# EAGLE design unity-gain-mixiple (EAGLE 7.7.0)
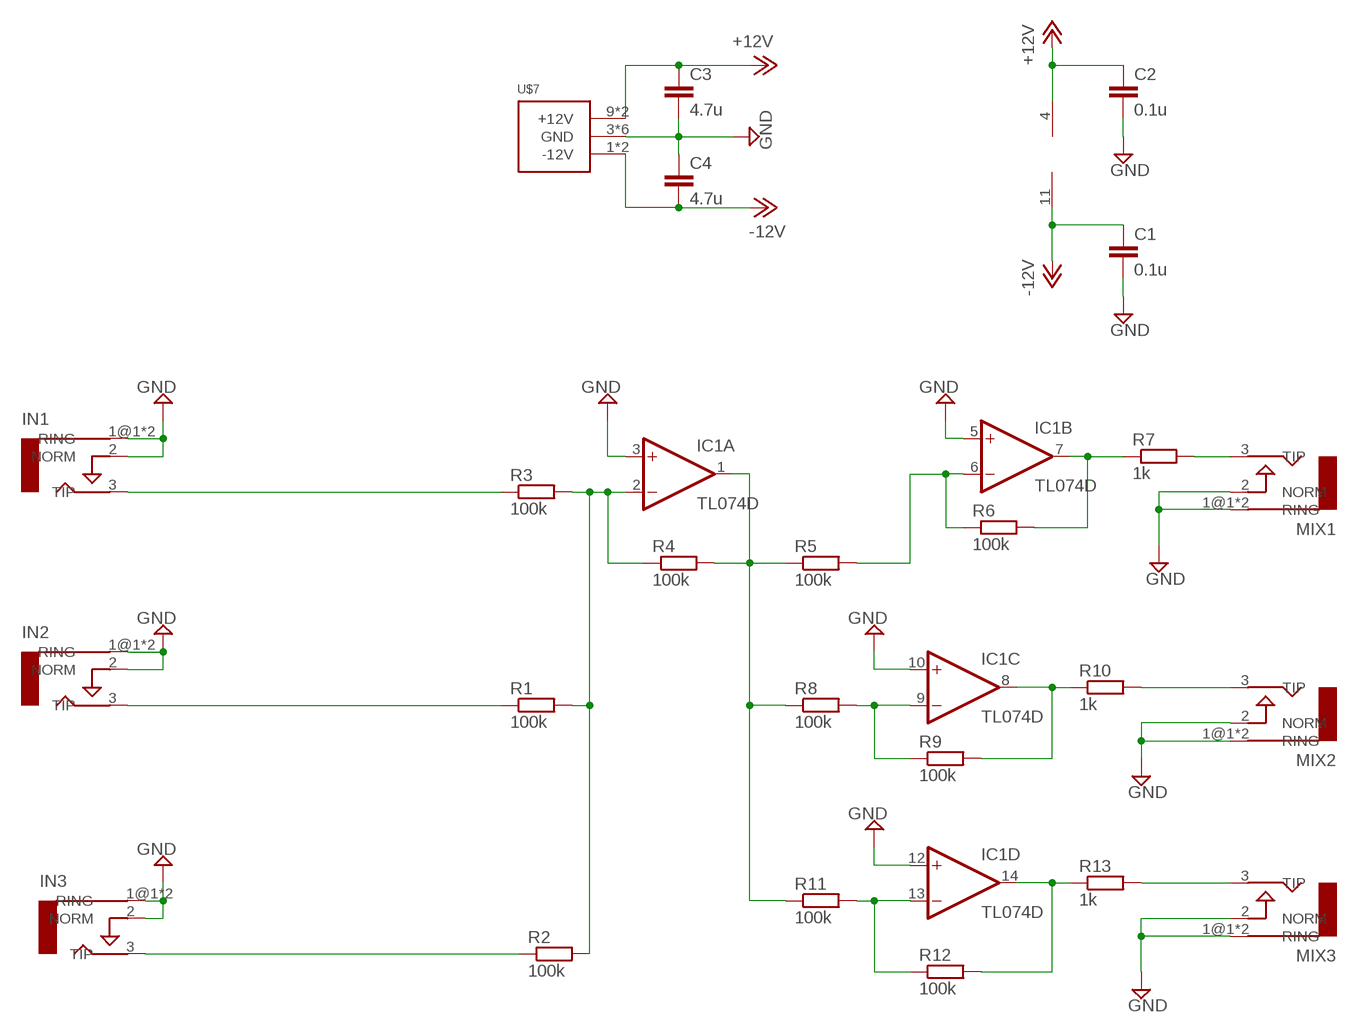
[diagram p0: schematic, sheet 1]

## Parts
C1  0.1u  C-EUC0805  [C0805]
C2  0.1u  C-EUC0805  [C0805]
C3  4.7u  C-EUC0805  [C0805]
C4  4.7u  C-EUC0805  [C0805]
IC1  TL074D  [SO14]
IN1  AUDIO-JACKERTHENVAR  [ERTHENVAR-JACK]
IN2  AUDIO-JACKERTHENVAR  [ERTHENVAR-JACK]
IN3  AUDIO-JACKERTHENVAR  [ERTHENVAR-JACK]
MIX1  AUDIO-JACKERTHENVAR  [ERTHENVAR-JACK]
MIX2  AUDIO-JACKERTHENVAR  [ERTHENVAR-JACK]
MIX3  AUDIO-JACKERTHENVAR  [ERTHENVAR-JACK]
R1  100k  R-EU_R0805  [R0805]
R2  100k  R-EU_R0805  [R0805]
R3  100k  R-EU_R0805  [R0805]
R4  100k  R-EU_R0805  [R0805]
R5  100k  R-EU_R0805  [R0805]
R6  100k  R-EU_R0805  [R0805]
R7  1k  R-EU_R0805  [R0805]
R8  100k  R-EU_R0805  [R0805]
R9  100k  R-EU_R0805  [R0805]
R10  1k  R-EU_R0805  [R0805]
R11  100k  R-EU_R0805  [R0805]
R12  100k  R-EU_R0805  [R0805]
R13  1k  R-EU_R0805  [R0805]
U$7  POWER_SIMPLE10  [POWER_10]

## Nets
+12V: C2.1 C3.1 IC1.4(P:V+) U$7.9(+12V) U$7.10(+12V)
-12V: C1.1 C4.2 IC1.11(P:V-) U$7.1(-12V) U$7.2(-12V)
GND: C1.2 C2.2 C3.2 C4.1 IC1.3(A:+IN) IC1.5(B:+IN) IC1.10(C:+IN) IC1.12(D:+IN) IN1.1@1(RING) IN1.1@2(RING) IN1.2(NORM) IN2.1@1(RING) IN2.1@2(RING) IN2.2(NORM) IN3.1@1(RING) IN3.1@2(RING) IN3.2(NORM) MIX1.1@1(RING) MIX1.1@2(RING) MIX1.2(NORM) MIX2.1@1(RING) MIX2.1@2(RING) MIX2.2(NORM) MIX3.1@1(RING) MIX3.1@2(RING) MIX3.2(NORM) U$7.3(GND) U$7.4(GND) U$7.5(GND) U$7.6(GND) U$7.7(GND) U$7.8(GND)
N$5: IC1.7(B:OUT) R6.2 R7.1
N$6: IC1.8(C:OUT) R9.2 R10.1
N$7: IC1.14(D:OUT) R12.2 R13.1
N$8: IC1.6(B:-IN) R5.2 R6.1
N$9: IC1.9(C:-IN) R8.2 R9.1
N$10: IC1.13(D:-IN) R11.2 R12.1
N$11: IN1.3(TIP) R3.1
N$12: IC1.2(A:-IN) R1.2 R2.2 R3.2 R4.1
N$13: IN2.3(TIP) R1.1
N$14: IN3.3(TIP) R2.1
N$15: IC1.1(A:OUT) R4.2 R5.1 R8.1 R11.1
N$17: MIX2.3(TIP) R10.2
N$18: MIX3.3(TIP) R13.2
N$19: MIX1.3(TIP) R7.2

## Library data of the parts
C1-C4 = rcl:C-EU: CAPACITOR, European symbol
IC1 = linear:TL074: OP AMP
IN1-IN3 MIX1-MIX3 = erthenvar:AUDIO-JACK: Switching Mono 3.5mm Audio Jack from Erthenvar.
R1-R13 = rcl:R-EU_: RESISTOR, European symbol
U$7 = eurorack:POWER_SIMPLE

## Board
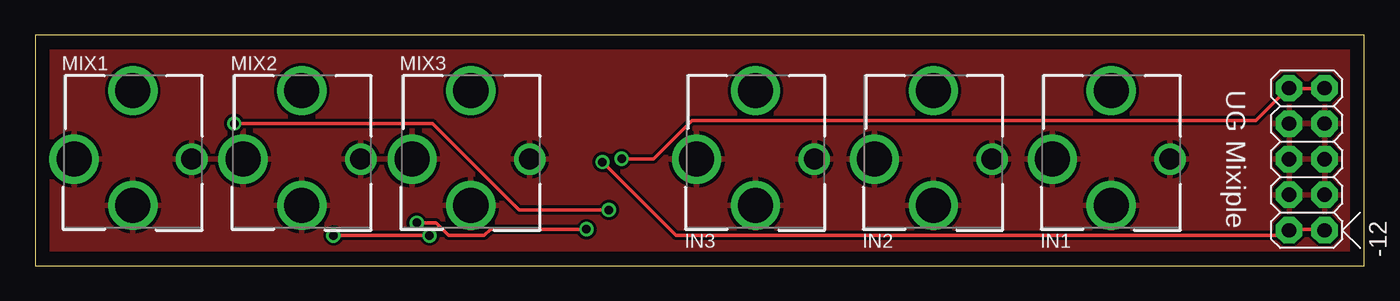
[diagram p1: board, top side]
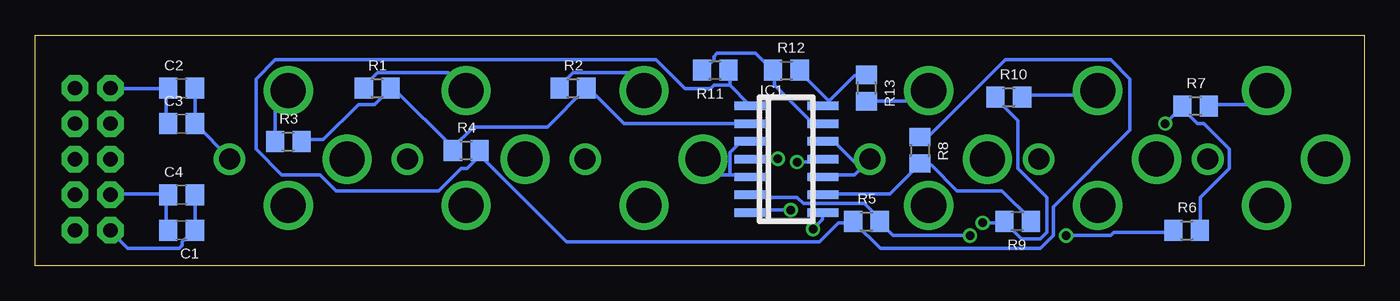
[diagram p2: board, bottom side, seen from below]

Size 94.92 x 16.5 mm. Coordinates in mm from the lower left corner, seen from the top.
Outline: 0,0 94.92,0 94.92,16.5 0,16.5 0,0
Copper layers (1*16): Top 0.035mm / dielectric 1.5mm / Bottom 0.035mm
Design rules "default": minimum track width 10mil, minimum drill 24mil, track to track 8mil, track to pad 8mil, pad to pad 8mil, via to via 8mil, smd to smd 8mil, copper to edge 40mil, drill to drill 8mil, minimum pad ring 10mil, minimum via ring 8mil, stop-mask expansion 4mil, vias tented up to drill 0mil, thermal gap 10mil

### Footprints (pad centres in the part's own frame; a part is rotated, then mirrored left to right if it is on the bottom)
C0805 = smd 1.3 x 1.5: 1 -0.95,0; 2 0.95,0
SO14 = smd 0.6 x 2.2: 1 -3.81,-2.6; 2 -2.54,-2.6; 3 -1.27,-2.6; 4 0,-2.6; 5 1.27,-2.6; 6 2.54,-2.6; 7 3.81,-2.6; 8 3.81,2.6; 9 2.54,2.6; 10 1.27,2.6; 11 0,2.6; 12 -1.27,2.6; 13 -2.54,2.6; 14 -3.81,2.6
ERTHENVAR-JACK = drill 2.5: 1@1 -4.2,0; 2 0,-3.3; 3 0,4.9 | drill 1.5: 1@2 4.2,0
R0805 = smd 1.3 x 1.5: 1 -0.95,0; 2 0.95,0
POWER_10 = drill 1.016 pad 1.88 octagon: 1 -5.08,-1.27; 2 -5.08,1.27; 3 -2.54,-1.27; 4 -2.54,1.27; 5 0,-1.27; 6 0,1.27; 7 2.54,-1.27; 8 2.54,1.27; 9 5.08,-1.27; 10 5.08,1.27

### Placement (x,y rotation side)
C1  84.45,2.54 180 bottom
C2  84.45,12.7 0 bottom
C3  84.45,10.16 0 bottom
C4  84.45,5.08 0 bottom
IC1  41.27,7.62 270 bottom
IN1  76.83,7.62 0 top
IN2  64.13,7.62 0 top
IN3  51.44,7.62 0 top
MIX1  6.99,7.62 0 top
MIX2  19.05,7.62 0 top
MIX3  31.11,7.62 0 top
R1  70.48,12.7 0 bottom
R2  56.52,12.7 0 bottom
R3  76.83,8.89 0 bottom
R4  64.13,8.26 0 bottom
R5  35.56,3.18 0 bottom
R6  12.7,2.54 0 bottom
R7  12.06,11.43 0 bottom
R8  31.75,8.26 270 bottom
R9  24.76,3.18 180 bottom
R10  25.4,12.07 0 bottom
R11  46.36,13.97 180 bottom
R12  41.27,13.97 0 bottom
R13  35.56,12.7 270 bottom
U$7  90.8,7.62 90 top

### Tracks (layer width: path | path; a pad name or v marks a point on that pad's centre or on a via)
+12V  (via drill 0.61)
  Top 0.254: v41.89,7.64 44.17,7.64 46.91,10.39 87.15,10.39 89.43,12.68 U$7.10 89.66,12.68 91.95,12.68 U$7.9
  Bottom 0.254: 85.55,12.68 85.55,10.16 C3.1 | v41.89,7.64 43.71,7.64 IC1.4 | 85.55,12.68 89.43,12.68 U$7.10 | 85.55,12.68 C2.1
-12V  (via drill 0.61)
  Top 0.254: v40.51,7.42 45.77,2.16 89.2,2.16 89.43,2.39 U$7.2 89.66,2.62 91.95,2.62 U$7.1
  Bottom 0.254: C4.2 83.49,4.9 83.49,2.62 C1.1 83.72,2.39 84.4,1.7 84.4,1.47 84.63,1.25 88.29,1.25 89.43,2.39 U$7.2 | v40.51,7.42 38.68,7.42 IC1.11
GND
  Bottom 0.254: 83.49,10.16 83.49,12.68 C2.2 | C1.2 85.55,2.62 85.55,4.9 C4.1 85.55,5.13 89.43,5.13 U$7.4 | 35.94,6.96 35.48,7.42 MIX3.1@2 35.94,6.96 | 35.94,6.96 36.4,6.5 38.46,6.5 IC1.10 | 45.31,6.5 46.23,6.5 47.14,7.42 IN3.1@1 | 45.31,6.5 43.94,6.5 IC1.5 | 35.94,6.96 37.77,8.79 38.46,8.79 IC1.12 | 45.31,6.5 45.31,8.1 44.63,8.79 43.94,8.79 IC1.3 | 83.49,10.16 80.97,7.64 IN1.1@2 | 83.49,10.16 C3.2
  pour Top: 0.64,16.51 94.61,16.51 94.61,0 0.64,0
N$5  (via drill 0.61)
  Top 0.254: v40.97,3.99 34.57,3.99 28.4,10.16 v14.22,10.16
  Bottom 0.254: 13.08,11.3 11.94,10.16 11.48,10.16 9.65,8.33 9.65,6.96 11.71,4.9 11.71,2.62 R6.2 | v40.97,3.99 43.71,3.99 IC1.7 | 13.08,11.3 v14.22,10.16 | 13.08,11.3 R7.1
N$6  (via drill 0.61)
  Top 0.254: v39.37,2.62 32.51,2.62 32.05,2.16 29.54,2.16 28.63,3.07 v27.25,3.07
  Bottom 0.254: R10.1 26.34,11.99 24.74,10.39 24.74,6.96 22.68,4.9 22.68,2.39 23.14,1.93 24.51,1.93 25.65,3.07 R9.2 25.88,3.07 v27.25,3.07 | v39.37,2.62 38.68,3.3 38.68,3.76 IC1.8
N$7
  Bottom 0.254: 38.23,11.76 38.46,11.53 IC1.14 | 38.23,11.76 36.4,13.59 35.71,13.59 R13.1 | 38.23,11.76 40.28,13.82 R12.2
N$8  (via drill 0.61)
  Top 0.254: v28.17,2.16 v21.31,2.16
  Bottom 0.254: v21.31,2.16 18.11,2.16 17.88,2.39 13.77,2.39 R6.1 | v28.17,2.16 33.66,2.16 34.57,3.07 R5.2 34.57,3.3 35.71,4.45 40.06,4.45 40.51,4.9 43.71,4.9 IC1.6
N$9
  Bottom 0.254: R9.1 23.82,3.3 25.88,5.36 29.08,5.36 30.91,7.19 31.6,7.19 R8.2 31.83,7.19 33.88,5.13 38.46,5.13 IC1.9
N$10
  Bottom 0.254: IC1.13 39.37,10.16 42.11,12.9 42.11,13.82 R12.1 42.34,14.05 43.48,15.19 46.23,15.19 46.46,14.96 46.46,14.73 47.14,14.05 R11.2
N$11
  Bottom 0.254: R3.1 77.77,9.02 77.77,11.53 76.86,12.45 IN1.3
N$12
  Bottom 0.254: R3.2 75.72,9.02 74.35,9.02 71.83,11.53 70.69,11.53 69.55,12.68 R1.2 69.32,12.68 64.97,8.33 R4.1 65.2,8.33 63.6,9.93 58.34,9.93 55.6,12.68 R2.2 55.37,12.68 52.86,10.16 IC1.2
N$13
  Bottom 0.254: R1.1 71.37,12.9 70.46,13.82 65.43,13.82 64.29,12.68 IN2.3
N$14
  Bottom 0.254: R2.1 57.43,12.9 56.52,13.82 52.63,13.82 51.49,12.68 IN3.3
N$15
  Bottom 0.254: 45.31,12.9 45.31,13.82 R11.1 | 45.31,12.9 43.94,11.53 IC1.1 | 63.14,7.87 63.37,8.1 R4.2 63.14,7.87 | 63.14,7.87 56.97,1.7 38.91,1.7 37.54,3.07 36.63,3.07 R5.1 36.4,3.07 34.57,1.25 23.14,1.25 22.22,2.16 22.22,4.22 16.74,9.7 16.74,13.36 18.11,14.73 25.65,14.73 31.14,9.25 31.6,9.25 R8.1 | 45.31,12.9 46.46,12.9 46.69,12.68 48.51,12.68 50.57,14.73 77.77,14.73 79.15,13.36 79.15,8.33 77.32,6.5 74.57,6.5 73.43,5.36 66.12,5.36 64.52,6.96 64.06,6.96 63.14,7.87
N$17
  Bottom 0.254: R10.2 24.28,12.22 19.48,12.22 19.25,12.45 MIX2.3
N$18
  Bottom 0.254: R13.2 35.48,11.76 31.83,11.76 31.14,12.45 MIX3.3
N$19
  Bottom 0.254: R7.2 11.02,11.53 8.05,11.53 7.14,12.45 MIX1.3

### Text on the board
tNames: UG Mixiple
bValues: Mixiple